# EAGLE design pr0board (EAGLE 9.6.2)
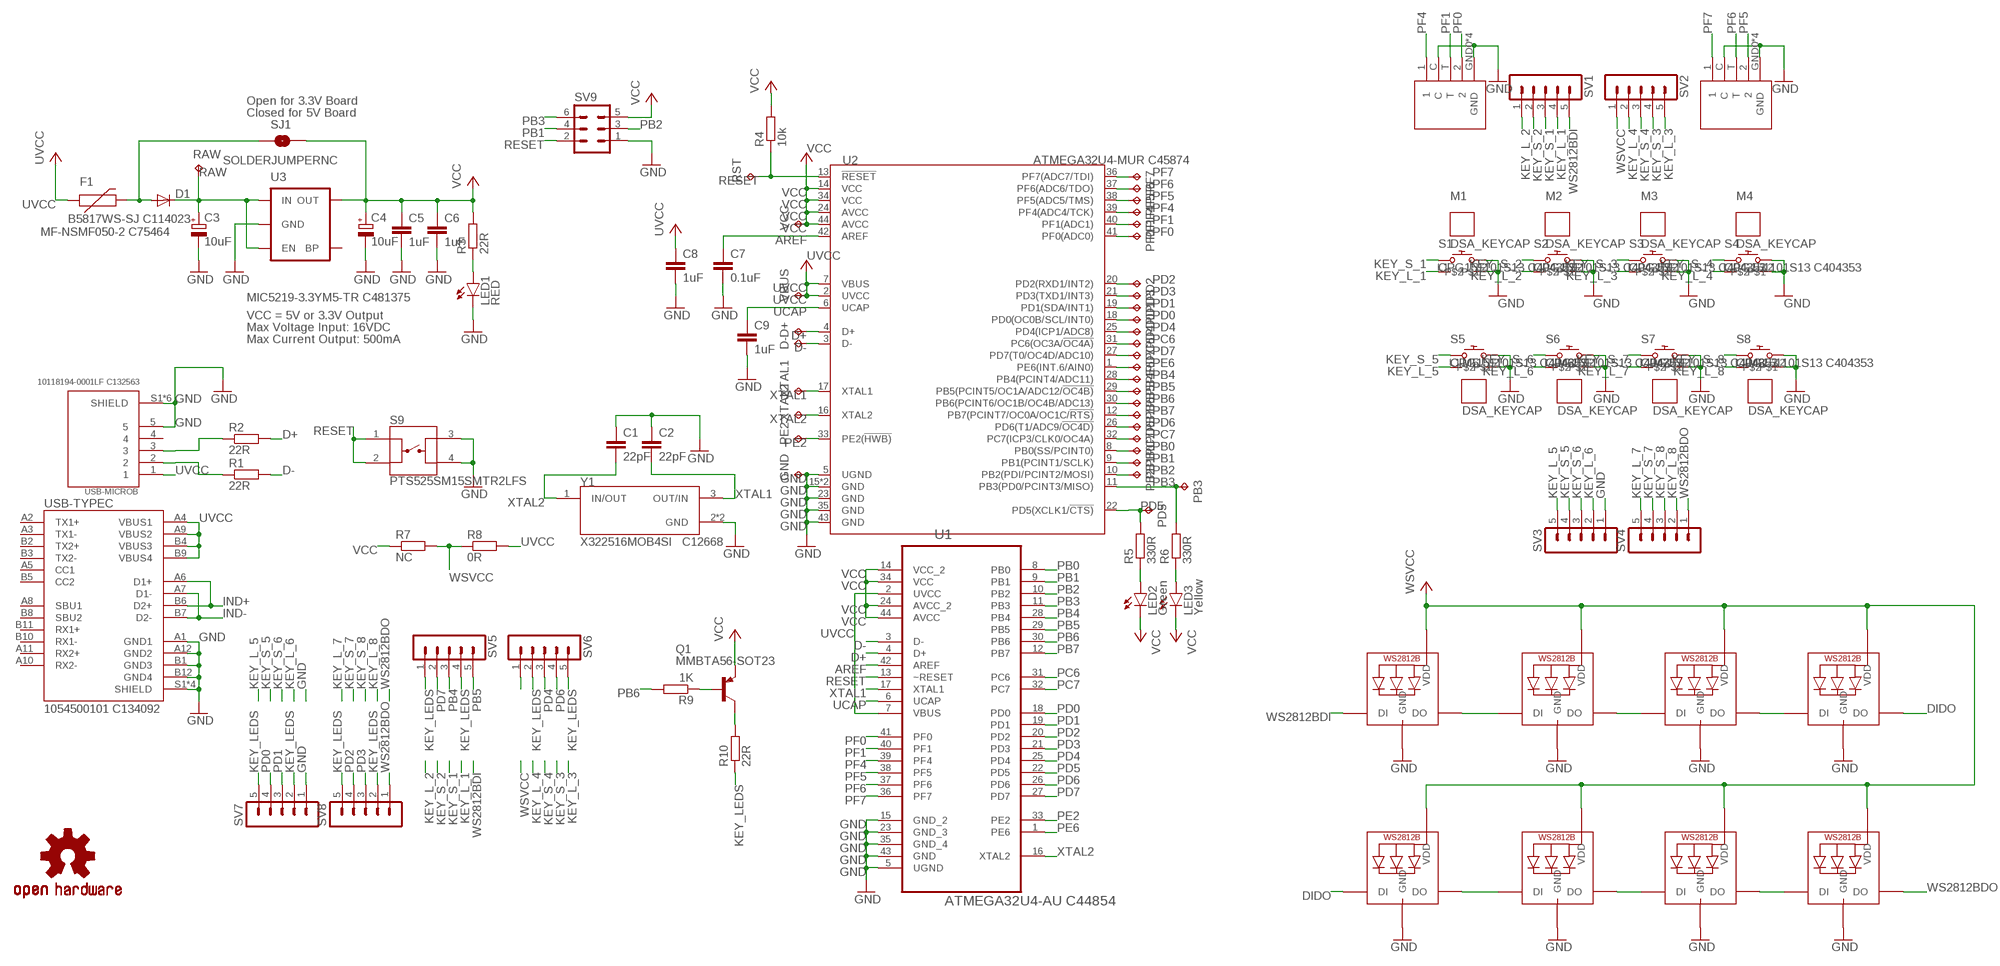
[diagram p0: schematic, sheet 1]

## Parts
C1  22pF  C-EUC0603  [C0603]
C2  22pF  C-EUC0603  [C0603]
C3  10uF  CPOL-EUCT3216  [CT3216]
C4  10uF  CPOL-EUCT3216  [CT3216]
C5  1uF  C-EUC0603  [C0603]
C6  1uF  C-EUC0603  [C0603]
C7  0.1uF  C-EUC0603  [C0603]
C8  1uF  C-EUC0603  [C0603]
C9  1uF  C-EUC0603  [C0603]
D1  B5817WS-SJ C114023  DIODESOD  [SOD-323]
D+  TPB1,27  [B1,27]
D-  TPB1,27  [B1,27]
F1  MF-NSMF050-2 C75464  PTCSMD  [PTC-1206]
GND  TPB1,27  [B1,27]
LED1  RED  LEDCHIP-LED0603  [CHIP-LED0603]
LED2  Green  LEDCHIP-LED0603  [CHIP-LED0603]
LED3  Yellow  LEDCHIP-LED0603  [CHIP-LED0603]
LED4  WS2812B3535  [LED3535]
LED5  WS2812B3535  [LED3535]
LED6  WS2812B3535  [LED3535]
LED7  WS2812B3535  [LED3535]
LED8  WS2812B3535  [LED3535]
LED9  WS2812B3535  [LED3535]
LED10  WS2812B3535  [LED3535]
LED11  WS2812B3535  [LED3535]
M1  DSA_KEYCAP  [DSA_KEYCAP]
M2  DSA_KEYCAP  [DSA_KEYCAP]
M3  DSA_KEYCAP  [DSA_KEYCAP]
M4  DSA_KEYCAP  [DSA_KEYCAP]
M5  DSA_KEYCAP  [DSA_KEYCAP]
M6  DSA_KEYCAP  [DSA_KEYCAP]
M7  DSA_KEYCAP  [DSA_KEYCAP]
M8  DSA_KEYCAP  [DSA_KEYCAP]
PB0  TPB1,27  [B1,27]
PB1  TPB1,27  [B1,27]
PB2  TPB1,27  [B1,27]
PB3  TPB1,27  [B1,27]
PB4  TPB1,27  [B1,27]
PB5  TPB1,27  [B1,27]
PB6  TPB1,27  [B1,27]
PB7  TPB1,27  [B1,27]
PC6  TPB1,27  [B1,27]
PC7  TPB1,27  [B1,27]
PD0  TPB1,27  [B1,27]
PD1  TPB1,27  [B1,27]
PD2  TPB1,27  [B1,27]
PD3  TPB1,27  [B1,27]
PD4  TPB1,27  [B1,27]
PD5  TPB1,27  [B1,27]
PD6  TPB1,27  [B1,27]
PD7  TPB1,27  [B1,27]
PE2  TPB1,27  [B1,27]
PE6  TPB1,27  [B1,27]
PF0  TPB1,27  [B1,27]
PF1  TPB1,27  [B1,27]
PF4  TPB1,27  [B1,27]
PF5  TPB1,27  [B1,27]
PF6  TPB1,27  [B1,27]
PF7  TPB1,27  [B1,27]
Q1  MMBTA56-SOT23  [SOT23]
R1  22R  R-EU_R0603  [R0603]
R2  22R  R-EU_R0603  [R0603]
R3  22R  R-EU_R0603  [R0603]
R4  10k  R-EU_R0603  [R0603]
R5  330R  R-EU_R0603  [R0603]
R6  330R  R-EU_R0603  [R0603]
R7  NC  R-EU_R0603  [R0603]
R8  0R  R-EU_R0603  [R0603]
R9  1K  R-EU_R0603  [R0603]
R10  22R  R-EU_R0805  [R0805]
RAW  TPB1,27  [B1,27]
RST  TPB1,27  [B1,27]
S1  CPG151101S13 C404353  CHERRY_MX_LED  [CHERRY_MX_LED]
S2  CPG151101S13 C404353  CHERRY_MX_LED  [CHERRY_MX_LED]
S3  CPG151101S13 C404353  CHERRY_MX_LED  [CHERRY_MX_LED]
S4  CPG151101S13 C404353  CHERRY_MX_LED  [CHERRY_MX_LED]
S5  CPG151101S13 C404353  CHERRY_MX_LED  [CHERRY_MX_LED]
S6  CPG151101S13 C404353  CHERRY_MX_LED  [CHERRY_MX_LED]
S7  CPG151101S13 C404353  CHERRY_MX_LED  [CHERRY_MX_LED]
S8  CPG151101S13 C404353  CHERRY_MX_LED  [CHERRY_MX_LED]
S9  PTS525SM15SMTR2LFS  [SW_PTS525SM15SMTR2LFS]
SJ1  SOLDERJUMPERNC  [SJ_2S]
SV1  MA05-1  [MA05-1]
SV2  MA05-1  [MA05-1]
SV3  MA05-1  [MA05-1]
SV4  MA05-1  [MA05-1]
SV5  MA05-1  [MA05-1]
SV6  MA05-1  [MA05-1]
SV7  MA05-1  [MA05-1]
SV8  MA05-1  [MA05-1]
SV9  MA03-2  [MA03-2]
U1  ATMEGA32U4-AU C44854  ATMEGA32U4-AU  [QFP80P1200X1200X120-44N]
U2  ATMEGA32U4-MUR C45874  MCU-ATMEGA32U4-MUR(VQFN44)  [QFN44G-0.5-7X7MM]
U3  MIC5219-3.3YM5-TR C481375  V_REG_LDOSMD2  [SC70]
U$1  OSHW-LOGOS  [OSHW-LOGO-S]
U$2  TM-2024A  [TM-2024A]
U$3  TM-2024A  [TM-2024A]
USB-MICROB  10118194-0001LF C132563  10118194-0001LF  [AMPHENOL_10118194-0001LF]
USB-TYPEC  1054500101 C134092  105450-0101  [MOLEX_105450-0101]
VBUS  TPB1,27  [B1,27]
VCC  TPB1,27  [B1,27]
XTAL1  TPB1,27  [B1,27]
XTAL2  TPB1,27  [B1,27]
Y1  X322516MOB4SI C12668  ECS-160-18-33Q-DS  [XTAL_ECS-160-18-33Q-DS]

## Nets
AREF: C7.1 U1.42(AREF) U2.42(AREF)
D+: D+.TP R2.2 U1.4(D+) U2.4(D+)
D-: D-.TP R1.2 U1.3(D-) U2.3(D-)
DIDO: LED7.3(DO) LED8.1(DI)
GND: C1.1 C2.1 C3.- C4.- C5.2 C6.2 C7.2 C8.2 C9.2 GND.TP LED1.C LED4.4(GND) LED5.4(GND) LED6.4(GND) LED7.4(GND) LED8.4(GND) LED9.4(GND) LED10.4(GND) LED11.4(GND) S1.L2 S1.S2 S2.L2 S2.S2 S3.L2 S3.S2 S4.L2 S4.S2 S5.L2 S5.S2 S6.L2 S6.S2 S7.L2 S7.S2 S8.L2 S8.S2 S9.3 S9.4 SV3.1 SV7.1 SV9.1 U1.5(UGND) U1.15(GND_2) U1.23(GND_3) U1.35(GND_4) U1.43(GND) U2.5(UGND) U2.15(GND) U2.23(GND) U2.35(GND) U2.43(GND) U2.TAB(GND) U3.2(GND) U$2.C U$2.GND0(GND) U$2.GND1(GND) U$2.GND2(GND) U$2.GND3(GND) U$3.C U$3.GND0(GND) U$3.GND1(GND) U$3.GND2(GND) U$3.GND3(GND) USB-MICROB.5 USB-MICROB.S1(SHIELD) USB-MICROB.S2(SHIELD) USB-MICROB.S3(SHIELD) USB-MICROB.S4(SHIELD) USB-MICROB.S5(SHIELD) USB-MICROB.S6(SHIELD) USB-TYPEC.A1(GND1) USB-TYPEC.A12(GND2) USB-TYPEC.B1(GND3) USB-TYPEC.B12(GND4) USB-TYPEC.S1(SHIELD) USB-TYPEC.S2(SHIELD) USB-TYPEC.S3(SHIELD) USB-TYPEC.S4(SHIELD) Y1.2(GND) Y1.4(GND)
IND+: R2.1 USB-MICROB.3 USB-TYPEC.A6(D1+) USB-TYPEC.B6(D2+)
IND-: R1.1 USB-MICROB.2 USB-TYPEC.A7(D1-) USB-TYPEC.B7(D2-)
KEY_L_1: S1.L1 SV1.4
KEY_L_2: S2.L1 SV1.1
KEY_L_3: S3.L1 SV2.5
KEY_L_4: S4.L1 SV2.2
KEY_L_5: S5.L1 SV3.5
KEY_L_6: S6.L1 SV3.2
KEY_L_7: S7.L1 SV4.5
KEY_L_8: S8.L1 SV4.2
KEY_LEDS: R10.1 SV5.1 SV5.4 SV6.2 SV6.5 SV7.2 SV7.5 SV8.2 SV8.5
KEY_S_1: S1.S1 SV1.3
KEY_S_2: S2.S1 SV1.2
KEY_S_3: S3.S1 SV2.4
KEY_S_4: S4.S1 SV2.3
KEY_S_5: S5.S1 SV3.4
KEY_S_6: S6.S1 SV3.3
KEY_S_7: S7.S1 SV4.4
KEY_S_8: S8.S1 SV4.3
N$1: D1.2(A) F1.2 SJ1.1
N$4: LED1.A R3.1
N$5: LED3.A R6.1
N$6: LED2.A R5.1
N$7: Q1.1(B) R9.1
N$8: LED4.3(DO) LED5.1(DI)
N$9: LED5.3(DO) LED6.1(DI)
N$10: LED6.3(DO) LED7.1(DI)
N$11: Q1.3(C) R10.2
N$13: LED8.3(DO) LED9.1(DI)
N$14: LED9.3(DO) LED10.1(DI)
N$15: LED10.3(DO) LED11.1(DI)
PB0: PB0.TP U1.8(PB0) U2.8(PB0(SS/PCINT0))
PB1: PB1.TP SV9.4 U1.9(PB1) U2.9(PB1(PCINT1/SCLK))
PB2: PB2.TP SV9.3 U1.10(PB2) U2.10(PB2(PDI/PCINT2/MOSI))
PB3: PB3.TP R6.2 SV9.6 U1.11(PB3) U2.11(PB3(PD0/PCINT3/MISO))
PB4: PB4.TP SV5.3 U1.28(PB4) U2.28(PB4(PCINT4/ADC11))
PB5: PB5.TP SV5.5 U1.29(PB5) U2.29(PB5(PCINT5/OC1A/ADC12/!OC4B))
PB6: PB6.TP R9.2 U1.30(PB6) U2.30(PB6(PCINT6/OC1B/OC4B/ADC13))
PB7: PB7.TP U1.12(PB7) U2.12(PB7(PCINT7/OC0A/OC1C/!RTS))
PC6: PC6.TP U1.31(PC6) U2.31(PC6(OC3A/!OC4A))
PC7: PC7.TP U1.32(PC7) U2.32(PC7(ICP3/CLK0/OC4A))
PD0: PD0.TP SV7.4 U1.18(PD0) U2.18(PD0(OC0B/SCL/INT0))
PD1: PD1.TP SV7.3 U1.19(PD1) U2.19(PD1(SDA/INT1))
PD2: PD2.TP SV8.4 U1.20(PD2) U2.20(PD2(RXD1/INT2))
PD3: PD3.TP SV8.3 U1.21(PD3) U2.21(PD3(TXD1/INT3))
PD4: PD4.TP SV6.3 U1.25(PD4) U2.25(PD4(ICP1/ADC8))
PD5: PD5.TP R5.2 U1.22(PD5) U2.22(PD5(XCLK1/!CTS))
PD6: PD6.TP SV6.4 U1.26(PD6) U2.26(PD6(T1/ADC9/!OC4D))
PD7: PD7.TP SV5.2 U1.27(PD7) U2.27(PD7(T0/OC4D/ADC10))
PE2: PE2.TP U1.33(PE2) U2.33(PE2(!HWB))
PE6: PE6.TP U1.1(PE6) U2.1(PE6(INT.6/AIN0))
PF0: PF0.TP U1.41(PF0) U2.41(PF0(ADC0)) U$2.2
PF1: PF1.TP U1.40(PF1) U2.40(PF1(ADC1)) U$2.T
PF4: PF4.TP U1.39(PF4) U2.39(PF4(ADC4/TCK)) U$2.1
PF5: PF5.TP U1.38(PF5) U2.38(PF5(ADC5/TMS)) U$3.2
PF6: PF6.TP U1.37(PF6) U2.37(PF6(ADC6/TDO)) U$3.T
PF7: PF7.TP U1.36(PF7) U2.36(PF7(ADC7/TDI)) U$3.1
RAW: C3.+ D1.1(C) RAW.TP U3.1(IN) U3.3(EN)
RESET: R4.1 RST.TP S9.1 S9.2 SV9.2 U1.13(~RESET) U2.13(!RESET)
UCAP: C9.1 U1.6(UCAP) U2.6(UCAP)
UVCC: C8.1 F1.1 R8.2 U1.2(UVCC) U1.7(VBUS) U2.2(UVCC) U2.7(VBUS) USB-MICROB.1 USB-TYPEC.A4(VBUS1) USB-TYPEC.A9(VBUS2) USB-TYPEC.B4(VBUS3) USB-TYPEC.B9(VBUS4) VBUS.TP
VCC: C4.+ C5.1 C6.1 LED2.C LED3.C Q1.2(E) R3.2 R4.2 R7.1 SJ1.2 SV9.5 U1.14(VCC_2) U1.24(AVCC_2) U1.34(VCC) U1.44(AVCC) U2.14(VCC) U2.24(AVCC) U2.34(VCC) U2.44(AVCC) U3.5(OUT) VCC.TP
WS2812BDI: LED4.1(DI) SV1.5
WS2812BDO: LED11.3(DO) SV4.1 SV8.1
WSVCC: LED4.2(VDD) LED5.2(VDD) LED6.2(VDD) LED7.2(VDD) LED8.2(VDD) LED9.2(VDD) LED10.2(VDD) LED11.2(VDD) R7.2 R8.1 SV2.1 SV6.1
XTAL1: C2.2 U1.17(XTAL1) U2.17(XTAL1) XTAL1.TP Y1.3(OUT/IN)
XTAL2: C1.2 U1.16(XTAL2) U2.16(XTAL2) XTAL2.TP Y1.1(IN/OUT)
Unconnected: U3.4(BP) USB-MICROB.4 USB-TYPEC.A2(TX1+) USB-TYPEC.A3(TX1-) USB-TYPEC.A5(CC1) USB-TYPEC.A8(SBU1) USB-TYPEC.A10(RX2-) USB-TYPEC.A11(RX2+) USB-TYPEC.B2(TX2+) USB-TYPEC.B3(TX2-) USB-TYPEC.B5(CC2) USB-TYPEC.B8(SBU2) USB-TYPEC.B10(RX1-) USB-TYPEC.B11(RX1+)

## Notes on the sheet
- Open for 3.3V Board
- Closed for 5V Board
- VCC = 5V or 3.3V Output
- Max Voltage Input: 16VDC
- Max Current Output: 500mA

## Library data of the parts
C1 C2 C5-C9 = rcl:C-EU: CAPACITOR, European symbol; SPICEPREFIX: C
C3 C4 = rcl:CPOL-EU: POLARIZED CAPACITOR, European symbol; SPICEPREFIX: C
D1 = SparkFun:DIODE: Diode These are standard reverse protection diodes and small signal diodes. SMA package can handle up to about 1A. SOD-323 can handle about 200mA. What the SOD-323 package when ordering, there are some mfgs out there that are 5-pin packages.
D+ D- GND PB0 PB1-PB7 PC6 PC7 PD0 PD1-PD7 PE2 PE6 PF0 PF1 PF4-PF7 RAW RST VBUS VCC XTAL1 XTAL2 = testpad:TP: Test pad
F1 = SparkFun:PTC: Resettable Fuse PTC Resettable Fuse. Spark Fun Electronics SKU : COM-08357
LED1-LED3 = led:LED: LED OSRAM: - CHIPLED LG R971, LG N971, LY N971, LG Q971, LY Q971, LO R971, LY R971 LH N974, LH R974 LS Q976, LO Q976, LY Q976 LO Q996 - Hyper CHIPLED LW Q18S LB Q993, LB Q99A, LB R99A - SideLED LS A670, LO A670, LY A670, LG A670, LP A670 LB A673, LV A673, LT A673, LW A673 LH A674 LY A675 LS A676, LA A676, LO A676, LY A676, LW A676 LS A679, LY A679, LG A679 - Hyper Micro SIDELED® LS Y876, LA Y876, LO Y876, LY Y876 LT Y87S - SmartLED LW L88C, LW L88S LB L89C, LB L89S, LG L890 LS L89K, LO L89K, LY L89K LS L896, LA L896, LO L896, LY L896 - TOPLED LS T670, LO T670, LY T670, LG T670, LP T670 LSG T670, LSP T670, LSY T670, LOP T670, LYG T670 LG T671, LOG T671, LSG T671 LB T673, LV T673, LT T673, LW T673 LH T674 LS T676, LA T676, LO T676, LY T676, LB T676, LH T676, LSB T676, LW T676 LB T67C, LV T67C, LT T67C, LS T67K, LO T67K, LY T67K, LW E67C LS E67B, LA E67B, LO E67B, LY E67B, LB E67C, LV E67C, LT E67C LW T67C LS T679, LY T679, LG T679 LS T770, LO T770, LY T770, LG T770, LP T770 LB T773, LV T773, LT T773, LW T773 LH T774 LS E675, LA E675, LY E675, LS T675 LS T776, LA T776, LO T776, LY T776, LB T776 LHGB T686 LT T68C, LB T68C - Hyper Mini TOPLED® LB M676 - Mini TOPLED Santana® LG M470 LS M47K, LO M47K, LY M47K Source: http://www.osram.convergy.de LUXEON: - LUMILED® LXK2-PW12-R00, LXK2-PW12-S00, LXK2-PW14-U00, LXK2-PW14-V00 LXK2-PM12-R00, LXK2-PM12-S00, LXK2-PM14-U00 LXK2-PE12-Q00, LXK2-PE12-R00, LXK2-PE12-S00, LXK2-PE14-T00, LXK2-PE14-U00 LXK2-PB12-K00, LXK2-PB12-L00, LXK2-PB12-M00, LXK2-PB14-N00, LXK2-PB14-P00, LXK2-PB14-Q00 LXK2-PR12-L00, LXK2-PR12-M00, LXK2-PR14-Q00, LXK2-PR14-R00 LXK2-PD12-Q00, LXK2-PD12-R00, LXK2-PD12-S00 LXK2-PH12-R00, LXK2-PH12-S00 LXK2-PL12-P00, LXK2-PL12-Q00, LXK2-PL12-R00 Source: www.luxeon.com KINGBRIGHT: KA-3528ASYC Source: www.kingbright.com
LED4-LED11 = adafruit:WS2812B
M1-M8 = cherry:DSA_KEYCAP: DSA keycap
Q1 = transistor-pnp:*-?: PNP Transistor
R1-R8 = resistor:R-EU_: RESISTOR, European symbol
R9 R10 = rcl:R-EU_: RESISTOR, European symbol; SPICEPREFIX: R
S1-S8 = cherry:CHERRY_MX_LED: Cherry MX with LED; FARNELL: 2292961; MOUSER: 540_MX1A_11NW
S9 = PTS525SM15SMTR2LFS:PTS525SM15SMTR2LFS: Switch Tactile N.O. SPST Round Button Gull Wing 0.02A 15VDC 1000000Cycles 1.569N SMD T/R Check prices <https://snapeda.com/parts/PTS525SM15SMTR2LFS/C%26K/view-part/?ref=eda>; AVAILABILITY: Warning; DESCRIPTION: Tactile Switch SPST-NO Top Actuated Surface Mount; MF: C&K; MOUSER-PURCHASE-URL: https://snapeda.com/shop?store=Mouser&id=756640; MP: PTS525SM15SMTR2LFS; PACKAGE: None; PRICE: None
SJ1 = SparkFun:SOLDERJUMPER: Solder Jumper Standard SMD solder jumper. Used to automate production. Two varients : Normally Open and Normally Closed are the same, but have different paste layers. NC will have a large amount of paste and should jumper during reflow.
SV1-SV8 = con-lstb:MA05-1: PIN HEADER; OC_FARNELL: unknown; OC_NEWARK: unknown
SV9 = con-lstb:MA03-2: PIN HEADER; OC_FARNELL: unknown; OC_NEWARK: unknown
U1 = ATMEGA32U4-AU:ATMEGA32U4-AU: 8-bit Microcontroller with ISP Flash and USB Controller Check prices <https://snapeda.com/parts/ATMEGA32U4-AU/Microchip%20Technology/view-part/?ref=eda>; AVAILABILITY: Good; DESCRIPTION: AVR AVR® ATmega Microcontroller IC 8-Bit 16MHz 32KB (16K x 16) FLASH 44-TQFP (10x10); DIGIKEY-PURCHASE-URL: https://snapeda.com/shop?store=DigiKey&id=4251478; MF: Microchip Technology; MOUSER-PURCHASE-URL: https://snapeda.com/shop?store=Mouser&id=4251478; MP: ATMEGA32U4-AU; PACKAGE: TQFP-44 Microchip Technology; PRICE: None
U2 = MCU-ATMEGA32U4-MUR_VQFN44_:MCU-ATMEGA32U4-MUR(VQFN44): 310010016 Check prices <https://snapeda.com/parts/ATMEGA32U4-MUR/Microchip/view-part/?ref=eda>; ARROW_ELECTRONICS-PURCHASE-URL: https://snapeda.com/shop?store=Arrow+Electronics&id=1750575; AVAILABILITY: Good; DESCRIPTION: AVR AVR® ATmega Microcontroller IC 8-Bit 16MHz 32KB (16K x 16) FLASH 44-VQFN (7x7); MF: Microchip; MOUSER-PURCHASE-URL: https://snapeda.com/shop?store=Mouser&id=1750575; MP: ATMEGA32U4-MUR; PACKAGE: VQFN-44 Microchip; PRICE: None
U3 = SparkFun:V_REG_LDO: Voltage Regulator LDO Standard 150mA LDO voltage regulator in SOT-23 layout. Micrel part MIC5205. BP (by-pass) pin is used to lower output noise with 470pF cap.
U$1 = SparkFun:OSHW-LOGO: Open Source Hardware Logo This logo indicates the piece of hardware it is found on incorporates a OSHW license and/or adheres to the definition of open source hardware found here: http://freedomdefined.org/OSHW
U$2 U$3 = TM-2024A:TM-2024A
USB-MICROB = 10118194-0001LF:10118194-0001LF: Micro Usb, 2.0 Type b, Rcpt, Smt Check prices <https://snapeda.com/parts/10118194-0001LF/Amphenol%20ICC%20%28FCI%29/view-part/?ref=eda>; ARROW_ELECTRONICS-PURCHASE-URL: https://snapeda.com/shop?store=Arrow+Electronics&id=4816633; AVAILABILITY: Good; DESCRIPTION: USB - micro B USB 2.0 Receptacle Connector 5 Position Surface Mount, Right Angle; Through Hole; DIGIKEY-PURCHASE-URL: https://snapeda.com/shop?store=DigiKey&id=4816633; MF: Amphenol ICC (FCI); MOUSER-PURCHASE-URL: https://snapeda.com/shop?store=Mouser&id=4816633; MP: 10118194-0001LF; PACKAGE: None; PRICE: None
USB-TYPEC = 105450-0101:105450-0101: USB Shielded I/O Receptacle; Type C; Right Angle; Surface Mount; Gold over Nickel Check prices <https://snapeda.com/parts/1054500101/Molex/view-part/?ref=eda>; AVAILABILITY: Good; DESCRIPTION: USB-C (USB TYPE-C) USB 3.2 Gen 2 (USB 3.1 Gen 2, Superspeed + (USB 3.1)) Receptacle Connector 24 Position Surface Mount, Right Angle; Through Hole; DIGIKEY-PURCHASE-URL: https://snapeda.com/shop?store=DigiKey&id=448528; MF: Molex; MP: 1054500101; PACKAGE: None; PRICE: None
Y1 = ECS-160-18-33Q-DS:ECS-160-18-33Q-DS: The ECX-33Q is a miniature SMD Crystal with a 3.2 x 2.5 mm footprint. AEC-Q200 Qualified. Check prices <https://snapeda.com/parts/ECS-160-18-33Q-DS/ECS%20Inc./view-part/?ref=eda>; ARROW_ELECTRONICS-PURCHASE-URL: https://snapeda.com/shop?store=Arrow+Electronics&id=2121221; AVAILABILITY: Good; DESCRIPTION: 16MHz ±30ppm Crystal 18pF 80 Ohms 4-SMD, No Lead; DIGIKEY-PURCHASE-URL: https://snapeda.com/shop?store=DigiKey&id=2121221; MF: ECS Inc.; MOUSER-PURCHASE-URL: https://snapeda.com/shop?store=Mouser&id=2121221; MP: ECS-160-18-33Q-DS; PACKAGE: SMD-4 ECS International; PRICE: None

## Board
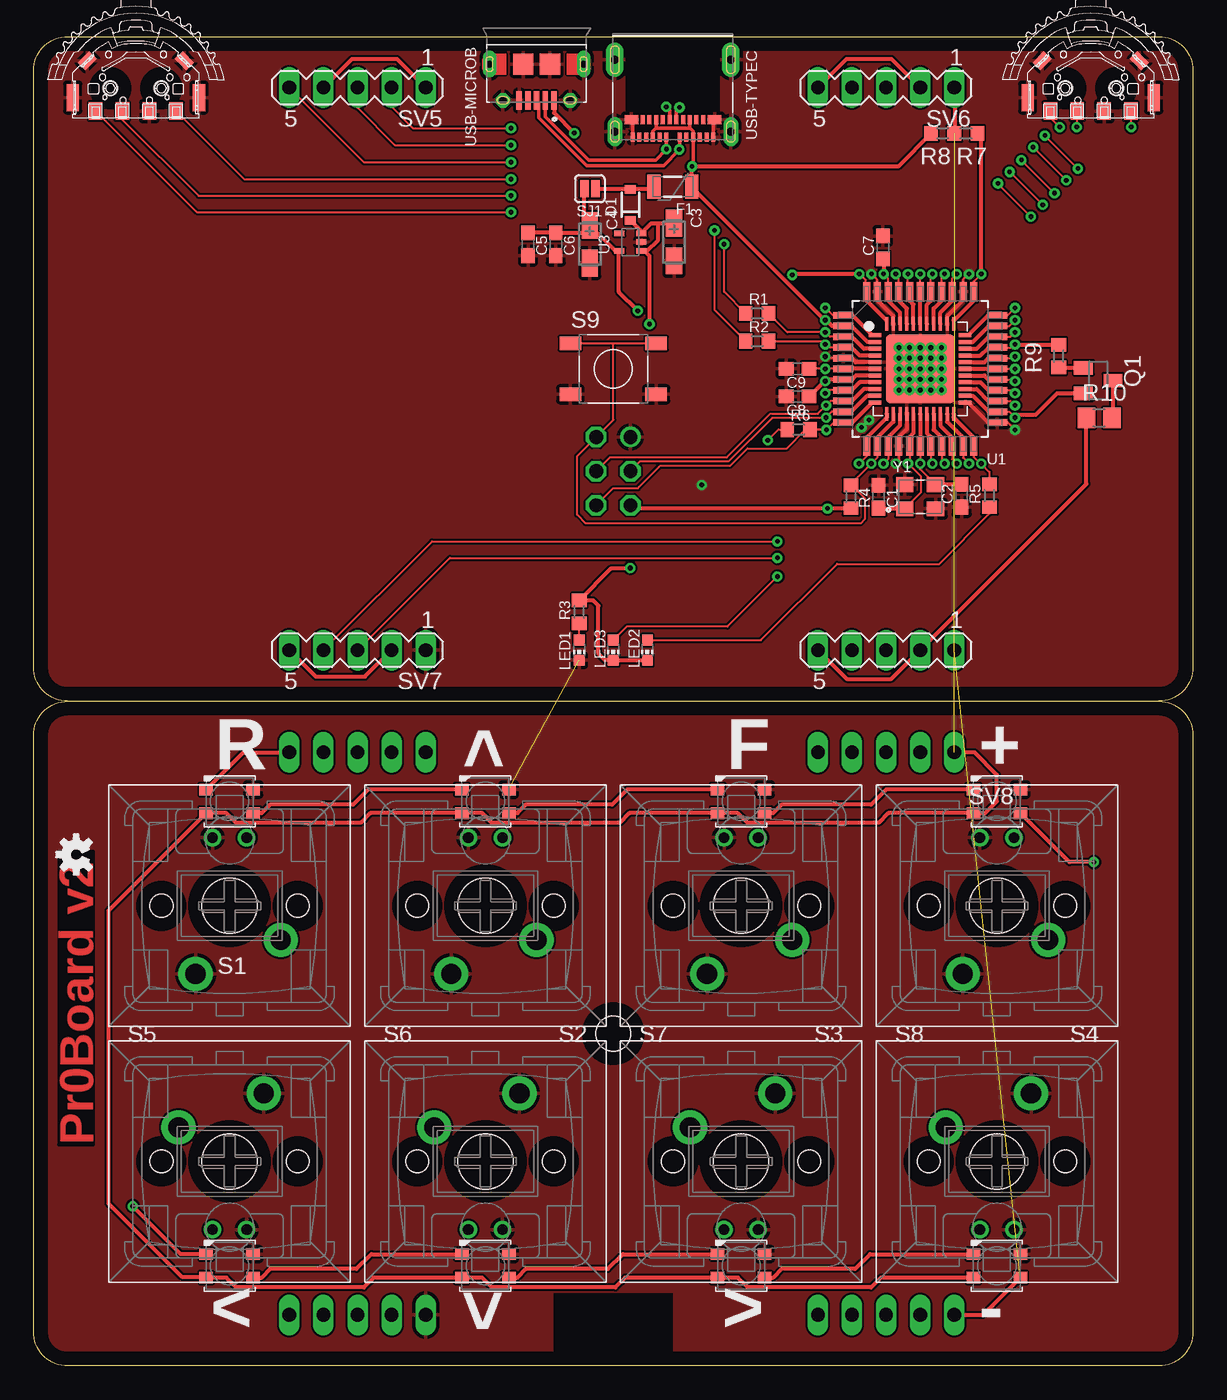
[diagram p1: board, top side]
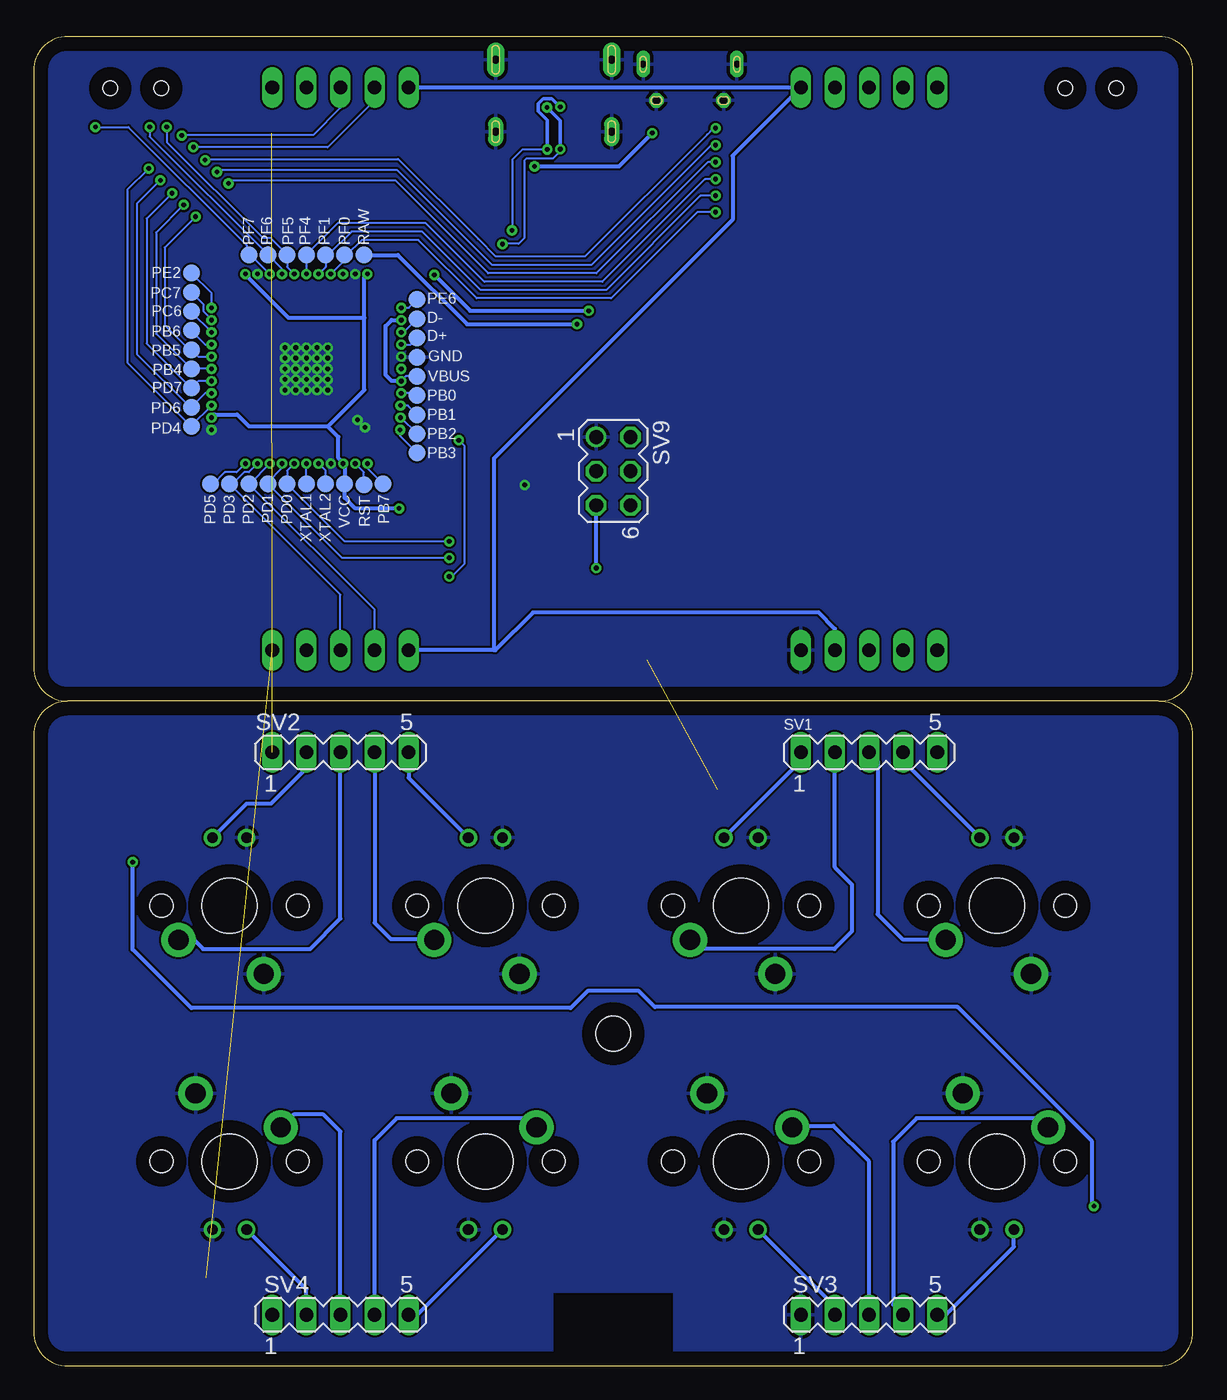
[diagram p2: board, bottom side, seen from below]

Size 86.36 x 99.06 mm. Coordinates in mm from the lower left corner, seen from the top.
Outline: 83.82,49.53 arc-90 86.36,46.99 86.36,2.54 arc-90 83.82,0 2.54,0 arc-90 0,2.54 0,46.99 arc-90 2.54,49.53
Outline: 2.54,49.53 arc-90 0,52.07 0,96.52 arc-90 2.54,99.06 83.82,99.06 arc-90 86.36,96.52 86.36,52.07 arc-90 83.82,49.53
Outline: 2.54,49.53 83.82,49.53
Copper layers (1*16): Top 0.035mm / dielectric 1.5mm / Bottom 0.035mm
Design rules "default": minimum track width 6mil, minimum drill 0.35mm, track to track 6mil, track to pad 6mil, pad to pad 6mil, via to via 6mil, smd to smd 6mil, copper to edge 40mil, drill to drill 6mil, minimum pad ring 10mil, minimum via ring 8mil, stop-mask expansion 4mil, vias tented up to drill 0mil, thermal gap 10mil
Holes 2.6 mm at 43.18,24.77
tRestrict: area 38.7,0 to 47.6,5.4; area 38.7,0 to 47.6,5.4
bRestrict: area 38.7,0 to 47.6,5.4

### Footprints (pad centres in the part's own frame; a part is rotated, then mirrored left to right if it is on the bottom)
C0603 = smd 1.1 x 1: 1 -0.85,0; 2 0.85,0
CT3216 = smd 2 x 1.2: + -1.4,0; - 1.4,0
SOD-323 = smd 0.63 x 0.83: 1 -1.15,0; 2 1.15,0
B1,27 = smd 1.27 x 1.27: TP 0,0
PTC-1206 = smd 1 x 1.8: 1 -1.4,0; 2 1.4,0
CHIP-LED0603 = smd 0.8 x 0.8: A 0,-0.75; C 0,0.75
LED3535 = smd 1 x 0.85: 1 -1.75,0.875; 2 -1.75,-0.875; 3 1.75,-0.875; 4 1.75,0.875
SOT23 = smd 1 x 1.4: 1 -0.95,-1.1; 2 0.95,-1.1; 3 0,1.1
R0603 = smd 1 x 1.1: 1 -0.85,0; 2 0.85,0
R0805 = smd 1.3 x 1.5: 1 -0.95,0; 2 0.95,0
CHERRY_MX_LED = drill 0.8: L1 -1.27,-5.08; L2 1.27,-5.08 | drill 1.5 pad 2.54: S1 -3.81,2.54; S2 2.54,5.08 | hole 1.7: -5.08,0; 5.08,0 | hole 4.1: 0,0
SW_PTS525SM15SMTR2LFS = smd 1.6 x 1: 1 -3.2,1.9; 2 3.2,1.9; 3 -3.2,-1.9; 4 3.2,-1.9
SJ_2S = smd 0.635 x 1.27: 1 -0.412,0; 2 0.412,0
MA05-1 = drill 1.016 long: 1 -5.08,0; 2 -2.54,0; 3 0,0; 4 2.54,0; 5 5.08,0
MA03-2 = drill 1.016: 1 -2.54,-1.27 | drill 1.016 octagon: 2 -2.54,1.27; 3 0,-1.27; 4 0,1.27; 5 2.54,-1.27; 6 2.54,1.27
QFP80P1200X1200X120-44N = smd 1.473 x 0.508: 1 -5.74,3.988; 2 -5.74,3.2; 3 -5.74,2.388; 4 -5.74,1.6; 5 -5.74,0.787; 6 -5.74,0; 7 -5.74,-0.787; 8 -5.74,-1.6; 9 -5.74,-2.388; 10 -5.74,-3.2; 11 -5.74,-3.988; 23 5.74,-3.988; 24 5.74,-3.2; 25 5.74,-2.388; 26 5.74,-1.6; 27 5.74,-0.787; 28 5.74,0; 29 5.74,0.787; 30 5.74,1.6; 31 5.74,2.388; 32 5.74,3.2; 33 5.74,3.988 | smd 0.508 x 1.473: 12 -3.988,-5.74; 13 -3.2,-5.74; 14 -2.388,-5.74; 15 -1.6,-5.74; 16 -0.787,-5.74; 17 0,-5.74; 18 0.787,-5.74; 19 1.6,-5.74; 20 2.388,-5.74; 21 3.2,-5.74; 22 3.988,-5.74; 34 3.988,5.74; 35 3.2,5.74; 36 2.388,5.74; 37 1.6,5.74; 38 0.787,5.74; 39 0,5.74; 40 -0.787,5.74; 41 -1.6,5.74; 42 -2.388,5.74; 43 -3.2,5.74; 44 -3.988,5.74
QFN44G-0.5-7X7MM = smd 1 x 0.3: 1 -3.35,2.5; 2 -3.35,2; 3 -3.35,1.5; 4 -3.35,1; 5 -3.35,0.5; 6 -3.35,0; 7 -3.35,-0.5; 8 -3.35,-1; 9 -3.35,-1.5; 10 -3.35,-2; 11 -3.35,-2.5; 23 3.35,-2.5; 24 3.35,-2; 25 3.35,-1.5; 26 3.35,-1; 27 3.35,-0.5; 28 3.35,0; 29 3.35,0.5; 30 3.35,1; 31 3.35,1.5; 32 3.35,2; 33 3.35,2.5 | smd 0.3 x 1: 12 -2.5,-3.35; 13 -2,-3.35; 14 -1.5,-3.35; 15 -1,-3.35; 16 -0.5,-3.35; 17 0,-3.35; 18 0.5,-3.35; 19 1,-3.35; 20 1.5,-3.35; 21 2,-3.35; 22 2.5,-3.35; 34 2.5,3.35; 35 2,3.35; 36 1.5,3.35; 37 1,3.35; 38 0.5,3.35; 39 0,3.35; 40 -0.5,3.35; 41 -1,3.35; 42 -1.5,3.35; 43 -2,3.35; 44 -2.5,3.35 | smd 5.08 x 5.08: TAB 0,0
SC70 = smd 0.4 x 0.75: 1 -0.65,-0.825; 2 0,-0.825; 3 0.65,-0.825; 4 0.65,0.825; 5 -0.65,0.825
TM-2024A = smd 1 x 1.3: 1 3,-0.95; 2 -3,-0.95; C 1,-0.95; T -1,-0.95 | smd 0.9 x 2: GND0 -4.7,0.05; GND3 4.7,0.05 | smd 1.2 x 0.8 rotated 45: GND1 -3.62,2.8 | smd 1.2 x 0.8 rotated 315: GND2 3.62,2.8 | hole 1.1: -1.9,0.75; 1.9,0.75
AMPHENOL_10118194-0001LF = smd 0.4 x 1.35: 1 -1.3,2.7; 2 -0.65,2.7; 3 0,2.7; 4 0.65,2.7; 5 1.3,2.7 | drill 0.55 pad 0.65 octagon: S1 -2.5,2.7; S2 2.5,2.7 | drill 0.5 pad 0.775 long: S3 -3.5,0; S6 3.5,0 | smd 1.5 x 1.55: S4 -1,0; S5 1,0
MOLEX_105450-0101 = smd 0.3 x 0.7: A1 -3,3.77; A2 -2.5,3.77; A3 -2,3.77; A4 -1.5,3.77; A5 -1,3.77; A6 -0.5,3.77; A7 0.5,3.77; A8 1,3.77; A9 1.5,3.77; A10 2,3.77; A11 2.5,3.77; A12 3,3.77; B2 2.25,2.47; B3 1.75,2.47; B4 1.25,2.47; B5 0.75,2.47; B6 0.25,2.47; B7 -0.25,2.47; B8 -0.75,2.47; B9 -1.25,2.47; B10 -1.75,2.47; B11 -2.25,2.47 | smd 1 x 0.7: B1 3.1,2.47; B12 -3.1,2.47 | drill 0.6 pad 1.1 long: S1 -4.32,3.36; S2 4.32,3.36 | drill 0.6 pad 1.3 long: S3 -4.32,-2; S4 4.32,-2
XTAL_ECS-160-18-33Q-DS = smd 1.3 x 1.1: 1 -1.15,-0.9; 2 1.15,-0.9; 3 1.15,0.9; 4 -1.15,0.9

### Placement (x,y rotation side)
C1  62.94,64.77 270 top
C2  69.14,64.85 90 top
C3  47.7,83.74 270 top
C4  41.43,83.58 270 top
C5  36.83,83.58 270 top
C6  38.89,83.58 270 top
C7  63.26,83.34 90 top
C8  56.91,72.23 180 top
C9  56.91,74.3 180 top
D1  44.45,86.52 90 top
D+  57.78,76.6 0 bottom
D-  57.78,78.03 0 bottom
F1  47.62,87.87 180 top
GND  57.78,75.17 0 bottom
LED1  40.64,53.34 180 top
LED2  45.72,53.34 180 top
LED3  43.18,53.34 180 top
LED4  14.61,42.07 0 top
LED5  33.66,42.07 0 top
LED6  52.7,42.07 0 top
LED7  71.75,42.07 0 top
LED8  14.61,7.46 0 top
LED9  33.66,7.46 0 top
LED10  52.7,7.46 0 top
LED11  71.75,7.46 0 top
M1  14.61,34.29 180 top
M2  33.66,34.29 180 top
M3  52.7,34.29 180 top
M4  71.75,34.29 180 top
M5  14.61,15.24 0 top
M6  33.66,15.24 0 top
M7  52.7,15.24 0 top
M8  71.75,15.24 0 top
PB0  57.78,72.31 0 bottom
PB1  57.78,70.88 0 bottom
PB2  57.78,69.45 0 bottom
PB3  57.78,68.02 0 bottom
PB4  74.61,74.3 0 bottom
PB5  74.61,75.72 0 bottom
PB6  74.61,77.15 0 bottom
PB7  60.33,65.72 0 bottom
PC6  74.61,78.58 0 bottom
PC7  74.61,80.01 0 bottom
PD0  67.47,65.72 0 bottom
PD1  68.9,65.72 0 bottom
PD2  70.33,65.72 0 bottom
PD3  71.75,65.72 0 bottom
PD4  74.61,70.01 0 bottom
PD5  73.18,65.72 0 bottom
PD6  74.61,71.44 0 bottom
PD7  74.61,72.87 0 bottom
PE2  74.61,81.44 0 bottom
PE6  57.78,79.45 0 bottom
PF0  63.18,82.79 0 bottom
PF1  64.61,82.79 0 bottom
PF4  66.04,82.79 0 bottom
PF5  67.47,82.79 0 bottom
PF6  68.9,82.79 0 bottom
PF7  70.33,82.79 0 bottom
Q1  79.3,73.42 270 top
R1  53.9,78.42 0 top
R2  53.9,76.36 0 top
R3  40.64,56.2 90 top
R4  60.88,64.77 270 top
R5  71.2,64.85 90 top
R6  56.99,69.77 0 top
R7  69.45,91.84 180 top
R8  67.71,91.84 180 top
R9  76.36,75.25 90 top
R10  79.38,70.64 0 top
RAW  61.75,82.79 0 bottom
RST  61.75,65.64 0 bottom
S1  14.61,34.29 180 top
S2  33.66,34.29 180 top
S3  52.7,34.29 180 top
S4  71.75,34.29 180 top
S5  14.61,15.24 0 top
S6  33.66,15.24 0 top
S7  52.7,15.24 0 top
S8  71.75,15.24 0 top
S9  43.18,74.3 0 top
SJ1  41.43,87.71 180 top
SV1  24.13,45.72 0 bottom
SV2  63.5,45.72 0 bottom
SV3  24.13,3.81 0 bottom
SV4  63.5,3.81 0 bottom
SV5  24.13,95.25 180 top
SV6  63.5,95.25 180 top
SV7  24.13,53.34 180 top
SV8  63.5,53.34 180 top
SV9  43.18,66.67 270 bottom
U1  66.04,74.3 0 top
U2  66.04,74.3 0 top
U3  44.45,83.74 90 top
U$1  3.17,38.1 90 top
U$2  7.62,94.46 0 top
U$3  78.74,94.46 0 top
USB-MICROB  37.47,97 180 top
USB-TYPEC  47.62,95.33 180 top
VBUS  57.78,73.74 0 bottom
VCC  63.18,65.72 0 bottom
XTAL1  66.04,65.72 0 bottom
XTAL2  64.61,65.72 0 bottom
Y1  66.04,64.77 0 top

### Tracks (layer width: path | path; a pad name or v marks a point on that pad's centre or on a via)
AREF  (via drill 0.35)
  Top 0.152: U1.42 63.65,81.02 v63.31,81.36
  Top 0.3: U2.42 64.54,78.49 63.65,79.38 U1.42
  Top 0.305: C7.1 63.31,82.44 v63.31,81.36
D+  (via drill 0.35)
  Top 0.152: U1.4 59.19,75.89 v58.98,76.11 58.73,76.36 R2.2
  Top 0.3: U2.4 61.54,75.3 60.94,75.89 U1.4
  Bottom 0.152: v58.98,76.11 58.27,76.11 D+.TP
D-  (via drill 0.35)
  Top 0.152: U1.3 59.31,76.68 v58.98,77.02 56.15,77.02 R1.2
  Top 0.3: U2.3 61.84,75.8 60.95,76.68 U1.3
  Bottom 0.152: v58.98,77.02 58.79,77.02 D-.TP
DIDO  (via drill 0.35)
  Top 0.305: LED8.1 10.95,8.34 v7.38,11.91 | v78.98,37.54 77.15,37.54 LED7.3
  Bottom 0.305: v7.38,11.91 7.51,12.03 7.51,16.72 17.54,26.75 40.08,26.75 41.27,27.94 45.09,27.94 46.35,26.67 74.61,26.67 78.98,31.04 v78.98,37.54
GND  (via drill 0.35)  (1 unrouted)
  Top 0.152: U1.5 59.1,75.08 v58.98,75.2 | U1.35 69.24,80.97 69.62,81.36 v69.67,81.36 | U1.43 62.84,80.92 v62.41,81.36 | U1.23 72.55,70.31 v73.1,69.75 | U1.15 64.44,67.46 v64.21,67.23
  Top 0.254: USB-TYPEC.A12 44.62,92.76 USB-TYPEC.B1 | USB-TYPEC.A1 50.62,92.76 USB-TYPEC.B12
  Top 0.3: U2.43 64.04,78.23 62.84,79.43 U1.43 | U2.35 68.04,78.23 69.24,79.43 U1.35 | U2.23 69.63,71.8 71.12,70.31 U1.23 | U2.15 65.04,69.8 64.44,69.2 U1.15 | U2.5 61.24,74.8 60.95,75.08 U1.5
  other vias: 66.83,74.3 67.63,74.3 65.25,74.3 64.45,74.3 66.04,75.09 66.83,75.09 67.63,75.09 65.25,75.09 64.45,75.09 64.45,73.5 65.25,73.5 66.04,73.5 66.83,73.5 67.63,73.5 67.63,72.71 66.83,72.71 66.04,72.71 65.25,72.71 64.45,72.71 64.45,75.88 65.25,75.88 66.04,75.88 66.83,75.88 67.63,75.88 49.77,65.64 62.23,70.48 61.67,69.93 66.04,74.3
  pour Bottom: -7.78,-12.3 -7.78,102.87 89.22,102.87 89.22,-12.3
  pour Top: -1.27,-8.65 -1.27,101.92 90.73,101.92 90.73,-8.65 81.84,-8.65
IND+  (via drill 0.35)
  Top 0.152: R2.1 50.72,78.68 v50.72,84.61
  Top 0.254: USB-TYPEC.A6 48.12,90.67 v48.1,90.65 48.1,90.62 46.93,89.45 41.19,89.45 37.64,93 37.64,94.13 USB-MICROB.3 | v47.12,93.82 47.38,93.57 USB-TYPEC.B6
  Bottom 0.152: v48.1,90.65 49.93,90.65 50.69,89.88 50.69,84.72 50.69,84.64 v50.72,84.61
  Bottom 0.254: v47.12,93.82 47.16,93.82 47.76,94.43 48.39,94.43 48.77,94.04 48.77,93.5 48.1,92.83 v48.1,90.65
IND-  (via drill 0.35)
  Top 0.152: R1.1 51.44,80.03 v51.44,83.58
  Top 0.254: USB-TYPEC.A7 v47.12,90.67 v47.13,90.66 46.33,89.85 41.35,89.85 38.12,93.09 USB-MICROB.2 | v48.11,93.77 47.88,93.53 47.88,93.18 USB-TYPEC.B7
  Bottom 0.152: v47.13,90.66 47.13,90.5 47.66,89.98 49.62,89.98 49.8,89.81 49.8,84.05 50.23,83.61 51.25,83.61 51.2,83.56 51.41,83.56 v51.44,83.58
  Bottom 0.254: v48.11,93.77 47.13,92.79 v47.13,90.66
KEY_L_1
  Bottom 0.305: SV1.4 21.59,45.09 S1.L1
KEY_L_2
  Bottom 0.305: S2.L1 29.21,45.09 SV1.1
KEY_L_3
  Bottom 0.305: SV2.5 58.42,43.81 S3.L1
KEY_L_4
  Bottom 0.305: SV2.2 66.04,44.54 68.67,41.91 70.48,41.91 S4.L1
KEY_L_5
  Bottom 0.305: S5.L1 13.34,8.89 18.41,3.81 SV3.5
KEY_L_6
  Bottom 0.305: SV3.2 26.67,4.45 S6.L1
KEY_L_7
  Bottom 0.305: SV4.5 57.78,3.81 S7.L1
KEY_L_8
  Bottom 0.305: SV4.2 66.04,5.71 S8.L1
KEY_LEDS
  Top 0.305: SV7.5 21.03,51.36 24.69,51.36 SV7.2 | SV8.5 60.56,51.2 63.9,51.2 SV8.2 78.42,65.72 R10.1 | SV6.5 60.56,97.39 63.9,97.39 SV6.2 | SV5.4 23.73,97.39 27.07,97.39 SV5.1
  Bottom 0.305: SV6.5 SV5.1 34.29,90.17 34.29,85.41 52.07,67.63 52.07,53.34 | 52.07,53.34 51.96,53.34 49.16,56.14 27.89,56.14 26.67,54.93 SV7.2 26.67,54.58 | 52.07,53.34 SV8.5
KEY_S_1
  Bottom 0.305: S1.S1 18.46,31.8 21.63,31.8 23.5,33.66 23.5,45.09 SV1.3
KEY_S_2
  Bottom 0.305: SV1.2 26.67,37.15 25.4,35.88 25.4,32.38 26.71,31.07 36.79,31.07 S2.S1
KEY_S_3
  Bottom 0.305: SV2.4 60.96,33.02 59.73,31.8 56.56,31.8 S3.S1
KEY_S_4
  Bottom 0.305: SV2.3 63.5,33.34 65.77,31.07 73.72,31.07 74.4,31.75 S4.S1
KEY_S_5
  Bottom 0.305: S5.S1 11.47,18.46 20.59,18.46 22.34,16.71 22.34,4.56 SV3.4
KEY_S_6
  Bottom 0.305: S6.S1 29.73,17.89 26.79,17.89 24.13,15.24 SV3.3
KEY_S_7
  Bottom 0.305: S7.S1 49.57,18.46 59.33,18.46 60.96,16.82 SV4.4
KEY_S_8
  Bottom 0.305: SV4.3 63.5,17.46 64.77,18.73 66.99,18.73 S8.S1
N$1
  Top 0.305: F1.2 46.15,87.95 45.91,87.71 44.49,87.71 D1.2 44.41,87.71 SJ1.1
N$4
  Top 0.152: LED1.A R3.1
N$5  (via drill 0.35)
  Top 0.152: LED3.A 44.18,55.09 51.67,55.09 v55.4,58.82 | v54.69,68.98 55.48,69.77 R6.1
  Bottom 0.152: v54.69,68.98 54.29,68.58 54.29,59.75 55.22,58.82 v55.4,58.82
N$6
  Top 0.152: LED2.A 54.17,54.09 59.85,59.77 67.47,59.77 71.2,63.5 R5.1
N$7
  Top 0.305: R9.1 78.17,74.4 Q1.1
N$8
  Top 0.305: LED4.3 16.99,41.19 17.62,41.83 23.81,41.83 24.93,42.94 LED5.1
N$9
  Top 0.305: LED5.3 36.04,41.19 36.67,41.83 43.1,41.83 44.21,42.94 LED6.1
N$10
  Top 0.305: LED6.3 55.09,41.19 55.73,41.83 62.39,41.83 63.5,42.94 LED7.1
N$11
  Top 0.305: Q1.3 80.4,70.71 R10.2
N$13
  Top 0.305: LED8.3 16.99,6.59 17.62,7.22 24.05,7.22 25.16,8.34 LED9.1
N$14
  Top 0.305: LED9.3 36.04,6.59 36.67,7.22 42.78,7.22 43.9,8.34 LED10.1
N$15
  Top 0.305: LED10.3 55.09,6.59 55.73,7.22 61.2,7.22 62.31,8.34 LED11.1
PB0  (via drill 0.35)
  Top 0.152: U1.8 59.19,72.69 v58.98,72.48
  Top 0.3: U2.8 61.55,73.3 60.95,72.69 U1.8
  Bottom 0.152: PB0.TP 57.95,72.48 v58.98,72.48
PB1  (via drill 0.35)
  Top 0.152: U1.9 59.37,71.91 v59.03,71.57 58.41,70.95 54.88,70.95 51.64,67.71 42.94,67.71 SV9.4
  Top 0.3: U2.9 61.84,72.8 60.95,71.91 U1.9
  Bottom 0.152: PB1.TP 58.47,71.57 v59.03,71.57
PB2  (via drill 0.35)
  Top 0.152: U1.10 59.47,71.09 v59.03,70.66 59.02,70.64 55.01,70.64 51.75,67.39 45.16,67.39 SV9.3
  Top 0.3: U2.10 62.11,72.3 60.91,71.09 U1.10
  Bottom 0.152: PB2.TP 58.99,70.66 v59.03,70.66
PB3  (via drill 0.35)
  Top 0.152: U1.11 59.61,70.31 v59.05,69.75 | v59.05,69.75 57.86,69.75 R6.2 | SV9.6 43.18,65.41 45.01,65.41 46.69,67.08 51.88,67.08 53.16,68.37 56.11,68.37 57.49,69.75 57.82,69.75 | v59.05,69.75 57.78,69.75 57.82,69.75 | R6.2 57.82,69.75 | R6.2 57.82,69.75
  Top 0.3: U2.11 62.45,71.8 60.96,70.31 U1.11
  Bottom 0.152: PB3.TP 59.05,69.29 v59.05,69.75
PB4  (via drill 0.35)
  Top 0.152: U1.28 v73.1,74.3 | SV5.3 24.13,93.74 26.91,90.96 v35.56,90.96 | v75.17,86.52 75.15,86.52 v72.7,88.97
  Top 0.3: U2.28 U1.28
  Bottom 0.152: v73.1,74.3 PB4.TP 77.23,76.91 77.23,84.45 v75.17,86.52 | v72.7,88.97 72.54,89.13 59.3,89.13 52.21,82.03 44.81,82.03 35.88,90.96 v35.56,90.96
PB5  (via drill 0.35)
  Top 0.152: U1.29 72.98,75.08 v73.1,75.2 | SV5.5 24.61,89.69 v35.56,89.69 | v71.83,88.11 74.29,85.65 v74.29,85.64
  Top 0.3: U2.29 70.83,74.8 71.12,75.08 U1.29
  Bottom 0.152: v73.1,75.2 74.09,75.2 PB5.TP 74.77,75.72 76.6,77.55 76.6,83.33 v74.29,85.64 | v35.56,89.69 36.16,89.69 44.44,81.41 52.49,81.41 59.43,88.35 71.59,88.35 v71.83,88.11
PB6  (via drill 0.35)
  Top 0.152: U1.30 72.89,75.89 v73.1,76.11
  Top 0.3: U2.30 70.53,75.3 71.13,75.89 U1.30
  Top 0.305: v73.1,76.11 76.34,76.11 R9.2
  Bottom 0.152: PB6.TP 73.57,76.11 v73.1,76.11
PB7  (via drill 0.35)
  Top 0.152: U1.12 62.05,67.8 v61.49,67.23
  Top 0.3: U2.12 63.54,70.67 62.05,69.19 U1.12
  Bottom 0.152: PB7.TP 61.49,66.89 v61.49,67.23
PC6  (via drill 0.35)
  Top 0.152: U1.31 72.77,76.68 v73.1,77.02
  Top 0.3: U2.31 70.24,75.8 71.13,76.68 U1.31
  Bottom 0.152: PC6.TP 74.61,78.53 v73.1,77.02
PC7  (via drill 0.35)
  Top 0.152: U1.32 72.67,77.5 v73.1,77.93
  Top 0.3: U2.32 69.94,76.3 71.15,77.5 U1.32
  Bottom 0.152: PC7.TP 73.71,79.11 73.71,78.59 73.1,77.98 v73.1,77.93
PD0  (via drill 0.35)
  Top 0.152: U1.18 66.83,67.35 v66.95,67.23 | SV7.4 29.69,61.44 v55.4,61.44
  Top 0.3: U2.18 66.54,69.51 66.83,69.22 U1.18
  Bottom 0.152: v66.95,67.23 67.47,66.71 PD0.TP 63.18,61.44 v55.4,61.44
PD1  (via drill 0.35)
  Top 0.152: U1.19 67.64,67.45 v67.86,67.23 | SV7.3 31,60.21 v55.4,60.21
  Top 0.3: U2.19 67.04,69.76 67.64,69.16 U1.19
  Bottom 0.152: v67.86,67.23 67.86,66.91 68.9,65.87 PD1.TP 63.38,60.21 v55.4,60.21
PD2  (via drill 0.35)
  Top 0.152: U1.20 68.43,67.57 v68.77,67.23
  Top 0.3: U2.20 67.54,70.08 68.43,69.19 U1.20
  Bottom 0.152: v68.77,67.23 70.28,65.72 PD2.TP 60.96,56.36 SV8.4
PD3  (via drill 0.35)
  Top 0.152: U1.21 69.24,67.67 v69.67,67.23
  Top 0.3: U2.21 68.04,70.36 69.24,69.16 U1.21
  Bottom 0.152: v69.67,67.23 70.32,66.59 70.68,66.59 71.55,65.72 PD3.TP 63.5,57.47 SV8.3
PD4  (via drill 0.35)
  Top 0.152: U1.25 72.77,71.91 v73.1,71.57 | v77.79,89.22 v75.33,91.68
  Top 0.3: U2.25 70.24,72.8 71.13,71.91 U1.25
  Bottom 0.152: v73.1,71.57 74.61,70.06 PD4.TP 79.38,74.77 79.38,87.63 v77.79,89.22 | SV6.3 63.5,93.74 65.48,91.76 75.25,91.76 v75.33,91.68
PD5  (via drill 0.35)
  Top 0.152: U1.22 70.03,67.74 70.53,67.23 v70.58,67.23 71.2,66.61 R5.2
  Top 0.3: U2.22 68.54,70.67 70.03,69.19 U1.22
  Bottom 0.152: v70.58,67.23 71.23,66.59 72.11,66.59 72.98,65.72 PD5.TP
PD6  (via drill 0.35)
  Top 0.152: U1.26 72.89,72.69 v73.1,72.48 | v76.91,88.34 v74.45,90.81
  Top 0.3: U2.26 70.53,73.3 71.13,72.69 U1.26
  Bottom 0.152: v73.1,72.48 73.57,72.48 PD6.TP 74.69,71.44 78.66,75.41 78.66,86.6 v76.91,88.34 | SV6.4 60.96,94.3 64.45,90.81 v74.45,90.81
PD7  (via drill 0.35)
  Top 0.152: U1.27 72.98,73.51 v73.1,73.39 | SV5.2 26.67,93.82 28.26,92.23 v35.56,92.23 | v73.58,89.85 v76.04,87.39
  Top 0.3: U2.27 70.83,73.8 71.12,73.5 U1.27
  Bottom 0.152: v73.1,73.39 74.09,73.39 PD7.TP 77.94,76.19 77.94,85.5 v76.04,87.39 | v35.56,92.23 35.72,92.23 36.2,91.76 45.3,82.66 51.92,82.66 53.25,83.99 59.2,89.93 73.5,89.93 v73.58,89.85
PE2  (via drill 0.35)
  Top 0.152: U1.33 72.55,78.28 v73.1,78.84
  Top 0.3: U2.33 69.63,76.8 71.12,78.28 U1.33
  Bottom 0.152: v73.1,78.84 73.1,79.93 PE2.TP
PE6  (via drill 0.35)
  Top 0.152: U1.1 59.53,78.28 v58.98,78.84
  Top 0.3: U2.1 62.45,76.8 60.96,78.28 U1.1
  Bottom 0.152: v58.98,78.84 58.4,78.84 PE6.TP
PF0  (via drill 0.35)
  Top 0.152: U1.41 64.44,81.14 v64.22,81.36 | U$2.2 12.15,85.97 v35.56,85.97
  Top 0.3: U2.41 65.04,78.79 64.44,79.39 U1.41
  Bottom 0.152: v64.22,81.36 63.18,82.4 PF0.TP 63.02,82.79 61.91,83.9 57.7,83.9 53.35,79.55 43.35,79.55 36.92,85.97 v35.56,85.97
PF1  (via drill 0.35)
  Top 0.152: U1.40 65.13,80.16 v65.13,81.36 | U$2.T 6.62,92.87 12.29,87.2 v35.56,87.2
  Top 0.3: U2.40 65.54,79.09 65.25,79.38 U1.40
  Bottom 0.152: v65.13,81.36 64.61,81.88 PF1.TP 64.4,82.79 62.67,84.52 57.42,84.52 53.06,80.17 43.71,80.17 36.68,87.2 v35.56,87.2
PF4  (via drill 0.35)
  Top 0.152: U1.39 v66.04,81.36 | U$2.1 15.7,88.42 v35.56,88.42
  Top 0.3: U2.39 U1.39
  Bottom 0.152: v66.04,81.36 PF4.TP 66.04,82.82 63.72,85.14 57.13,85.14 52.78,80.79 44,80.79 36.37,88.42 v35.56,88.42
PF5  (via drill 0.35)
  Top 0.152: U1.38 66.83,81.24 v66.95,81.36 | U$3.2 75.74,93.01 v76.44,92.31
  Top 0.3: U2.38 66.54,79.08 66.83,79.37 U1.38
  Bottom 0.152: v66.95,81.36 67.47,81.88 PF5.TP 68.74,84.06 69.29,84.06 76.44,91.2 v76.44,92.31
PF6  (via drill 0.35)
  Top 0.152: U1.37 67.64,81.14 v67.86,81.36 | U$3.T 77.71,93.47 v77.71,92.31
  Top 0.3: U2.37 67.04,78.78 67.64,79.38 U1.37
  Bottom 0.152: v67.86,81.36 67.86,81.75 PF6.TP 77.71,91.6 v77.71,92.31
PF7  (via drill 0.35)
  Top 0.152: U1.36 68.43,81.02 v68.77,81.36 | U$3.1 81.74,92.33 v81.76,92.31
  Top 0.3: U2.36 67.54,78.49 68.43,79.38 U1.36
  Bottom 0.152: v68.77,81.36 69.95,82.54 70.33,82.54 PF7.TP 70.48,82.95 70.48,83.5 79.3,92.31 v81.76,92.31
RAW  (via drill 0.35)
  Top 0.305: D1.1 45.27,84.54 U3.3 46.02,85.14 46.51,85.14 | 46.51,85.14 C3.+ | U3.1 45.48,83.09 | 45.48,83.09 45.7,83.09 46.51,83.9 46.51,85.14 | v45.88,77.62 45.88,82.69 45.48,83.09
  Bottom 0.305: RAW.TP 61.74,82.78 59.22,82.78 54.07,77.62 v45.88,77.62
RESET  (via drill 0.35)
  Top 0.152: U1.13 62.84,67.67 v62.4,67.23 60.88,65.71 R4.1 60.95,65.62 61.9,64.67 61.9,63.09 61.6,62.79 41.12,62.79 40.48,63.42 40.48,67.79 SV9.2 43.18,70.48 43.18,76.19 | S9.1 43.18,76.19 | 43.18,76.19 46.2,76.19
  Top 0.3: U2.13 64.04,70.36 62.84,69.16 U1.13
  Top 0.305: 46.2,76.19 S9.2
  Bottom 0.152: RST.TP 61.75,66.59 v62.4,67.23
UCAP  (via drill 0.35)
  Top 0.152: U1.6 v58.98,74.3 C9.1
  Top 0.3: U2.6 U1.6
UVCC  (via drill 0.35)
  Top 0.254: USB-TYPEC.A9 46.12,92 46.38,92.25 | USB-TYPEC.B4 46.38,92.25 | 46.38,92.25 46.4,92.23 48.85,92.23 48.88,92.25 | USB-TYPEC.B9 48.88,92.25 | 48.88,92.25 49.13,92 49.13,91.57 USB-TYPEC.A4 49.13,89.45 v49.05,89.37 | U1.2 60.94,77.5
  Top 0.3: U2.7 61.25,73.8 60.97,73.51 | U2.2 62.13,76.3 60.94,77.5
  Top 0.305: USB-MICROB.1 38.77,93.37 v40.27,91.86 | U1.2 59.49,77.5 59.05,77.93 v58.98,77.93 58.92,77.93 49.02,87.82 F1.1 49.02,89.35 v49.05,89.37 64.39,89.37 R8.2 | 60.97,73.51 U1.7 59.1,73.51 v58.98,73.39 58.92,73.39 C8.1
  Bottom 0.152: VBUS.TP 58.62,73.74 v58.98,73.39
  Bottom 0.305: v49.05,89.37 42.76,89.37 v40.27,91.86 | v58.98,73.39 59.69,73.39 60.13,73.83 60.13,77.48 59.69,77.93 v58.98,77.93
VCC  (via drill 0.35)
  Top 0.152: U1.34 70.03,80.8 v70.58,81.36 | U1.44 61.99,80.1 61.99,80.91 61.55,81.36 v61.5,81.36 | U1.24 72.67,71.09 v73.1,70.66 | U1.14 63.65,67.58 v63.31,67.23
  Top 0.254: U2.34 68.54,77.91 | U2.44 63.54,77.88 | U1.14 63.65,69.21
  Top 0.3: U2.14 64.54,70.1 63.65,69.21 | 63.54,77.88 62.05,79.37 U1.44 | U1.24 71.15,71.09 69.94,72.3 U2.24 | U1.34 70.03,79.39 68.54,77.91
  Top 0.305: v73.1,70.66 73.33,70.89 74.64,70.89 76.23,72.47 Q1.2 | C5.1 C6.1 40.88,84.43 C4.+ | C4.+ 43.33,83.09 U3.5 43.6,83.07 43.6,80.03 v45.01,78.62 | C4.+ 41.02,85.39 SJ1.2 | v70.58,81.36 70.58,91.56 R7.1 | LED2.C LED3.C 42.55,52.59 42.07,53.07 42.07,56.65 41.67,57.05 R3.2 43.04,59.45 v44.45,59.45 | SV9.5 44.69,63.9 v59.13,63.9 60.86,63.9 R4.2 | v61.5,81.36 56.58,81.36 v56.52,81.3
  Bottom 0.305: v44.45,59.45 SV9.5 | 64.45,70 63.66,69.22 63.66,67.64 63.31,67.29 v63.31,67.23 63.18,67.11 VCC.TP 63.18,64.69 62.39,63.9 v59.13,63.9 | 64.45,70 64.47,70.03 70.33,70.03 71.2,70.9 72.87,70.9 v73.1,70.66 | v61.5,81.36 61.72,81.13 61.72,78.11 | 64.45,70 61.72,72.73 61.72,78.11 | v70.58,81.36 70.36,81.13 70.36,81.08 67.39,78.11 61.72,78.11 | v45.01,78.62 53.84,78.62 v56.52,81.3
WS2812BDI
  Top 0.305: LED4.1 15.63,45.72 SV1.5
WS2812BDO  (1 unrouted)
  Top 0.305: SV4.1 70.73,3.81 LED11.3
WSVCC  (1 unrouted)
  Top 0.254: SV6.1 68.6,95.23
  Top 0.305: 68.6,95.23 R7.2 R8.1 | LED10.2 50.8,6.59 | 50.8,6.59 44.06,6.59 43.33,5.86 34.14,5.86 33.41,6.59 LED9.2 25.33,6.59 24.6,5.86 15.09,5.86 14.36,6.59 LED8.2 12.83,6.61 11.08,6.61 5.6,12.09 5.6,33.94 LED4.2 14.36,41.19 15.09,40.46 24.36,40.46 25.09,41.19 LED5.2 33.41,41.19 34.14,40.46 43.65,40.46 44.38,41.19 50.8,41.19 | LED11.2 63.11,6.59 62.38,5.86 53.19,5.86 52.46,6.59 50.8,6.59 | LED6.2 50.8,41.19 | 50.8,41.19 52.46,41.19 53.19,40.46 62.94,40.46 63.67,41.19 LED7.2 70.88,41.19 71.75,42.07 71.75,44.05 70.09,45.72 SV2.1
XTAL1  (via drill 0.35)
  Top 0.152: U1.17 v66.04,67.23 66.04,66.82 Y1.3
  Top 0.3: U2.17 U1.17
  Top 0.305: C2.2 69.11,65.67 Y1.3
  Bottom 0.152: XTAL1.TP v66.04,67.23
XTAL2  (via drill 0.35)
  Top 0.152: U1.16 65.25,67.35 65.15,67.25 | 65.15,67.25 v65.13,67.23 | Y1.1 66.12,65.1 66.12,66.28 65.15,67.25
  Top 0.3: U2.16 65.54,69.51 65.25,69.22 65.25,68.56 U1.16
  Top 0.305: C1.2 62.99,63.87 Y1.1
  Bottom 0.152: XTAL2.TP 64.61,66.71 v65.13,67.23

### Text on the board
Top: Pr0Board v2
tNames: R | > | F | + | < | < | > | -
tStop: Pr0Board v2